# EAGLE schematic Programmer (EAGLE 6.5.0)
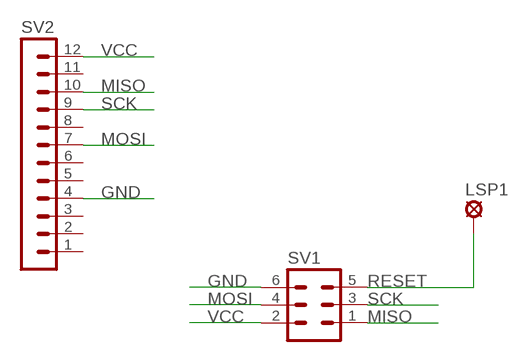
[diagram p0: schematic, sheet 1]

## Parts
LSP1  MCS10B  [MCS10B]
SV1  MA03-2  [MA03-2]
SV2  MA12-1W  [MA12-1W]

## Nets
GND: SV1.6 SV2.4
MISO: SV1.1 SV2.10
MOSI: SV1.4 SV2.7
RESET: LSP1.MP SV1.5
SCK: SV1.3 SV2.9
VCC: SV1.2 SV2.12
Unconnected: SV2.1 SV2.2 SV2.3 SV2.5 SV2.6 SV2.8 SV2.11

## Library data of the parts
LSP1 = solpad:MCS10B: SOLDER PAD MC S1, distributor Buerklin, 15F505
SV1 = con-lstb:MA03-2: PIN HEADER; OC_FARNELL: unknown; OC_NEWARK: unknown
SV2 = con-lstb:MA12-1W: PIN HEADER; OC_FARNELL: unknown; OC_NEWARK: unknown